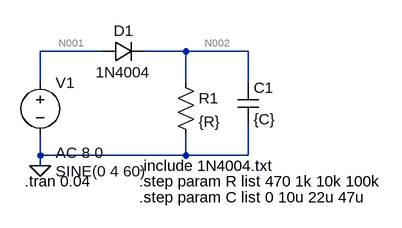
[diagram p0: schematic Lab2Pre.asc]
Lab2Pre.asc, the LTspice schematic file:
Version 4
SHEET 1 880 680
WIRE 144 80 48 80
WIRE 272 80 208 80
WIRE 368 80 272 80
WIRE 48 128 48 80
WIRE 272 128 272 80
WIRE 368 128 368 80
WIRE 48 240 48 208
WIRE 272 240 272 208
WIRE 272 240 48 240
WIRE 368 240 368 192
WIRE 368 240 272 240
WIRE 48 256 48 240
FLAG 48 256 0
SYMBOL voltage 48 112 R0
WINDOW 3 24 152 Left 2
WINDOW 123 24 124 Left 2
WINDOW 39 0 0 Left 2
SYMATTR InstName V1
SYMATTR Value SINE(0 4 60)
SYMATTR Value2 AC 8 0
SYMBOL diode 144 96 R270
WINDOW 0 32 32 VTop 2
WINDOW 3 0 32 VBottom 2
SYMATTR InstName D1
SYMATTR Value 1N4004
SYMBOL res 256 112 R0
SYMATTR InstName R1
SYMATTR Value {R}
SYMBOL cap 352 128 R0
SYMATTR InstName C1
SYMATTR Value {C}
TEXT 200 256 Left 2 !.include 1N4004.txt
TEXT 200 280 Left 2 !.step param R list 470 1k 10k 100k
TEXT 200 304 Left 2 !.step param C list 0 10u 22u 47u
TEXT 24 280 Left 2 !.tran 0.04

The netlist it stands for:
* Lab2Pre.asc
V1 N001 0 SINE(0 4 60) AC 8 0
D1 N001 N002 1N4004
R1 N002 0 {R}
C1 N002 0 {C}
.model D D
.lib standard.dio
.include 1N4004.txt
.step param R list 470 1k 10k 100k
.step param C list 0 10u 22u 47u
.tran 0.04
.backanno
.end

* Results of the author's LTspice run, read from the files saved beside the schematic
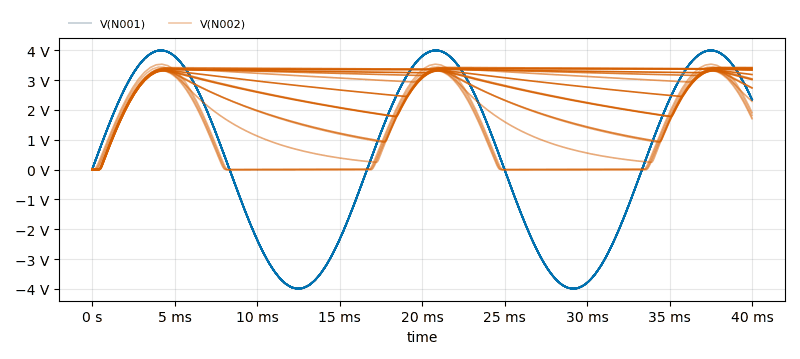
[diagram p1: Transient Analysis of Lab2Pre.asc, plotted from the saved traces]
* Transient Analysis, 16 runs:
*   V(N001) [r=470 c=0]: min -3.995 V, max 4 V, average 479.6 mV, rms 2.872 V, last 2.351 V
*   V(N001) [r=1000 c=0]: min -3.998 V, max 3.999 V, average 479.7 mV, rms 2.872 V, last 2.351 V
*   V(N001) [r=10000 c=0]: min -3.996 V, max 3.994 V, average 479.5 mV, rms 2.872 V, last 2.351 V
*   V(N001) [r=100000 c=0]: min -4 V, max 4 V, average 479.2 mV, rms 2.871 V, last 2.351 V
*   V(N001) [r=470 c=1e-005]: min -4 V, max 4 V, average 480.3 mV, rms 2.872 V, last 2.351 V
*   V(N001) [r=1000 c=1e-005]: min -3.995 V, max 4 V, average 480.3 mV, rms 2.873 V, last 2.351 V
*   V(N001) [r=10000 c=1e-005]: min -4 V, max 4 V, average 480.3 mV, rms 2.873 V, last 2.351 V
*   V(N001) [r=100000 c=1e-005]: min -3.998 V, max 4 V, average 480.3 mV, rms 2.873 V, last 2.351 V
*   V(N002) [r=470 c=0]: min -39.29 µV, max 3.322 V, average 1.176 V, rms 1.765 V, last 1.701 V
*   V(N002) [r=1000 c=0]: min -83.38 µV, max 3.352 V, average 1.192 V, rms 1.785 V, last 1.731 V
*   V(N002) [r=10000 c=0]: min -835 µV, max 3.44 V, average 1.242 V, rms 1.846 V, last 1.822 V
*   V(N002) [r=100000 c=0]: min -8.329 mV, max 3.537 V, average 1.292 V, rms 1.908 V, last 1.914 V
*   V(N002) [r=470 c=1e-005]: min 0 V, max 3.321 V, average 1.615 V, rms 1.937 V, last 2.289 V
*   V(N002) [r=1000 c=1e-005]: min 0 V, max 3.349 V, average 2.077 V, rms 2.241 V, last 2.746 V
*   V(N002) [r=10000 c=1e-005]: min 0 V, max 3.405 V, average 3.054 V, rms 3.106 V, last 3.338 V
*   V(N002) [r=100000 c=1e-005]: min 0 V, max 3.431 V, average 3.244 V, rms 3.299 V, last 3.424 V